# Altium schematic sheet FPGA_Memory.SchDoc
size A3; SheetNumber: 6; SheetTotal: 10
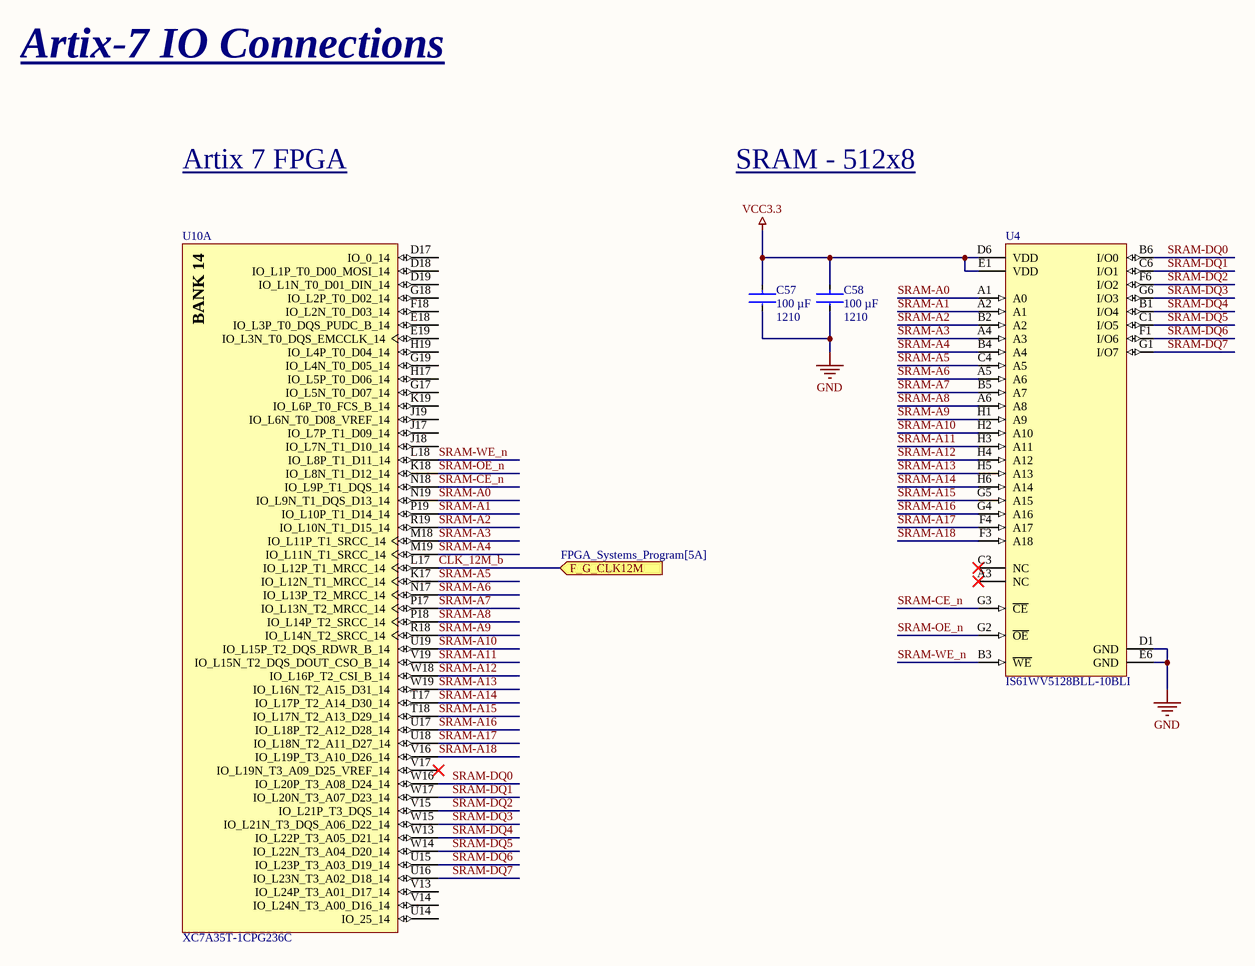
[diagram p0: FPGA_Memory.SchDoc]

## Parts
C57  Case Code (Imperial): 1210  Capacitance: 100 µF  [FP-CL32-IPC_C]  (hidden comment: CL32A107MQVNNNE)
C58  Case Code (Imperial): 1210  Capacitance: 100 µF  [FP-CL32-IPC_C]  (hidden comment: CL32A107MQVNNNE)
U4  IS61WV5128BLL-10BLI  [FP-IS61WV5128BLL-10BLI-IPC_A]
U10  XC7A35T-1CPG236C  [CPG236]  (part A of 10)

## Ports
F_G_CLK12M (in, see FPGA_Systems_Program[5A])

## Nets
GND: C57.2 C58.2 U4.D1(GND) U4.E6(GND)
VCC3.3: C57.1 C58.1 U4.D6(VDD) U4.E1(VDD)
CLK_12M_b: U10.L17(IO_L12P_T1_MRCC_14) ; port F_G_CLK12M
SRAM-A0: U4.A1(A0) U10.N19(IO_L9N_T1_DQS_D13_14)
SRAM-A1: U4.A2(A1) U10.P19(IO_L10P_T1_D14_14)
SRAM-A2: U4.B2(A2) U10.R19(IO_L10N_T1_D15_14)
SRAM-A3: U4.A4(A3) U10.M18(IO_L11P_T1_SRCC_14)
SRAM-A4: U4.B4(A4) U10.M19(IO_L11N_T1_SRCC_14)
SRAM-A5: U4.C4(A5) U10.K17(IO_L12N_T1_MRCC_14)
SRAM-A6: U4.A5(A6) U10.N17(IO_L13P_T2_MRCC_14)
SRAM-A7: U4.B5(A7) U10.P17(IO_L13N_T2_MRCC_14)
SRAM-A8: U4.A6(A8) U10.P18(IO_L14P_T2_SRCC_14)
SRAM-A9: U4.H1(A9) U10.R18(IO_L14N_T2_SRCC_14)
SRAM-A10: U4.H2(A10) U10.U19(IO_L15P_T2_DQS_RDWR_B_14)
SRAM-A11: U4.H3(A11) U10.V19(IO_L15N_T2_DQS_DOUT_CSO_B_14)
SRAM-A12: U4.H4(A12) U10.W18(IO_L16P_T2_CSI_B_14)
SRAM-A13: U4.H5(A13) U10.W19(IO_L16N_T2_A15_D31_14)
SRAM-A14: U4.H6(A14) U10.T17(IO_L17P_T2_A14_D30_14)
SRAM-A15: U4.G5(A15) U10.T18(IO_L17N_T2_A13_D29_14)
SRAM-A16: U4.G4(A16) U10.U17(IO_L18P_T2_A12_D28_14)
SRAM-A17: U4.F4(A17) U10.U18(IO_L18N_T2_A11_D27_14)
SRAM-A18: U4.F3(A18) U10.V16(IO_L19P_T3_A10_D26_14)
SRAM-CE_n: U4.G3(~{CE}) U10.N18(IO_L9P_T1_DQS_14)
SRAM-DQ0: U4.B6(I/O0) U10.W16(IO_L20P_T3_A08_D24_14)
SRAM-DQ1: U4.C6(I/O1) U10.W17(IO_L20N_T3_A07_D23_14)
SRAM-DQ2: U4.F6(I/O2) U10.V15(IO_L21P_T3_DQS_14)
SRAM-DQ3: U4.G6(I/O3) U10.W15(IO_L21N_T3_DQS_A06_D22_14)
SRAM-DQ4: U4.B1(I/O4) U10.W13(IO_L22P_T3_A05_D21_14)
SRAM-DQ5: U4.C1(I/O5) U10.W14(IO_L22N_T3_A04_D20_14)
SRAM-DQ6: U4.F1(I/O6) U10.U15(IO_L23P_T3_A03_D19_14)
SRAM-DQ7: U4.G1(I/O7) U10.U16(IO_L23N_T3_A02_D18_14)
SRAM-OE_n: U4.G2(~{OE}) U10.K18(IO_L8N_T1_D12_14)
SRAM-WE_n: U4.B3(~{WE}) U10.L18(IO_L8P_T1_D11_14)

Not connected (* = marked no-connect by the designer): U4 A3(NC)* C3(NC)*; U10 D17(IO_0_14) D18(IO_L1P_T0_D00_MOSI_14) D19(IO_L1N_T0_D01_DIN_14) E18(IO_L3P_T0_DQS_PUDC_B_14) E19(IO_L3N_T0_DQS_EMCCLK_14) F18(IO_L2N_T0_D03_14) G17(IO_L5N_T0_D07_14) G18(IO_L2P_T0_D02_14) G19(IO_L4N_T0_D05_14) H17(IO_L5P_T0_D06_14) H19(IO_L4P_T0_D04_14) J17(IO_L7P_T1_D09_14) J18(IO_L7N_T1_D10_14) J19(IO_L6N_T0_D08_VREF_14) K19(IO_L6P_T0_FCS_B_14) U14(IO_25_14) V13(IO_L24P_T3_A01_D17_14) V14(IO_L24N_T3_A00_D16_14) V17(IO_L19N_T3_A09_D25_VREF_14)*

## Notes on the sheet
- Artix-7 IO Connections
- Artix 7 FPGA
- SRAM - 512x8
- (in symbol CMP-0383-00006-1, part A) BANK 14

## Library data of the parts
C57 C58 = CMP-13271-001330-1: CAP CER 100UF 6.3V X5R 1210; Tolerance: 20%; Material: Ceramic; Voltage: 6.3V; Voltage Rating (DC): 6.3V; Length: 3.2mm; Width: 0.098inch; Thickness: 0.11inch; Dielectric: X5R; Packaging: Tape and Reel; Voltage Rating: 6.3V; Min Operating Temperature: -55°C; Lead Free: Lead Free; Radiation Hardening: No; Height: 2.5mm; Depth: 2.5mm; Case Code (Metric): 3225; Mount: Surface Mount; Package Quantity: 1; Case/Package: 1210; Max Operating Temperature: 85°C; Contact Plating: Tin
U4 = CMP-0513-00068-2: NexarPartId: 11886108; Density: 4Mb; Min Supply Voltage: 2.4V; Memory Type: SRAM; Number of Words: 512000; Nominal Supply Current: 40mA; Access Time: 10ns; Interface: Parallel; Memory Size: 512kB; Number of Ports: 1; Word Size: 8b; Sync/Async: Asynchronous; Address Bus Width: 19b; Max Supply Voltage: 3.6V; Number of Pins: 36; RoHS: Compliant; Min Operating Temperature: -40°C; Height: 1.2mm; Case/Package: BGA; Max Operating Temperature: 85°C; Ambient Temperature Range High: 85°C; Schedule B: 8542320040, 8542320040; Radiation Hardening: No
U10 = CMP-0383-00006-1: Artix-7 FPGA, 106 User I/Os, 2 GTP, 238-Ball BGA, Speed Grade 1, Commercial Grade, Pb-Free; Manufacturer: Xilinx; CMTs: 5; Total Block RAM: 1800 Kb; Logic Cells: 33280; Speed Grades: 1; GTP: 2; Available User I/O: 106; ComponentLink1URL: http://www.xilinx.com/; Maximum Distributed RAM: 400 Kb; PackageVersion: Rev. 1.11; PartNumber: XC7A35T-1CPG236C; ComponentLink2URL: http://www.xilinx.com/support/documentation/data_sheets/ds180_7Series_Overview.pdf; DatasheetVersion: Rev. 1.15; ComponentLink1Description: Manufacturer URL; ComponentLink3Description: Pinout; ComponentLink4Description: Package Specification; Mounting Technology: Surface Mount; PackageReference: CPG-236; Operating Temperature Range: Commercial; PackageDescription: 238-Ball Wire-Bond Chip-Scale BGA, Body 10 x10 mm, Pitch 0.5 mm; ComponentLink3URL: http://www.xilinx.com/support/documentation/user_guides/ug475_7Series_Pkg_Pinout.pdf; ComponentLink4URL: http://www.xilinx.com/support/documentation/user_guides/ug475_7Series_Pkg_Pinout.pdf; ComponentLink2Description: Datasheet